# EAGLE schematic mippe_base (EAGLE 9.5.0)
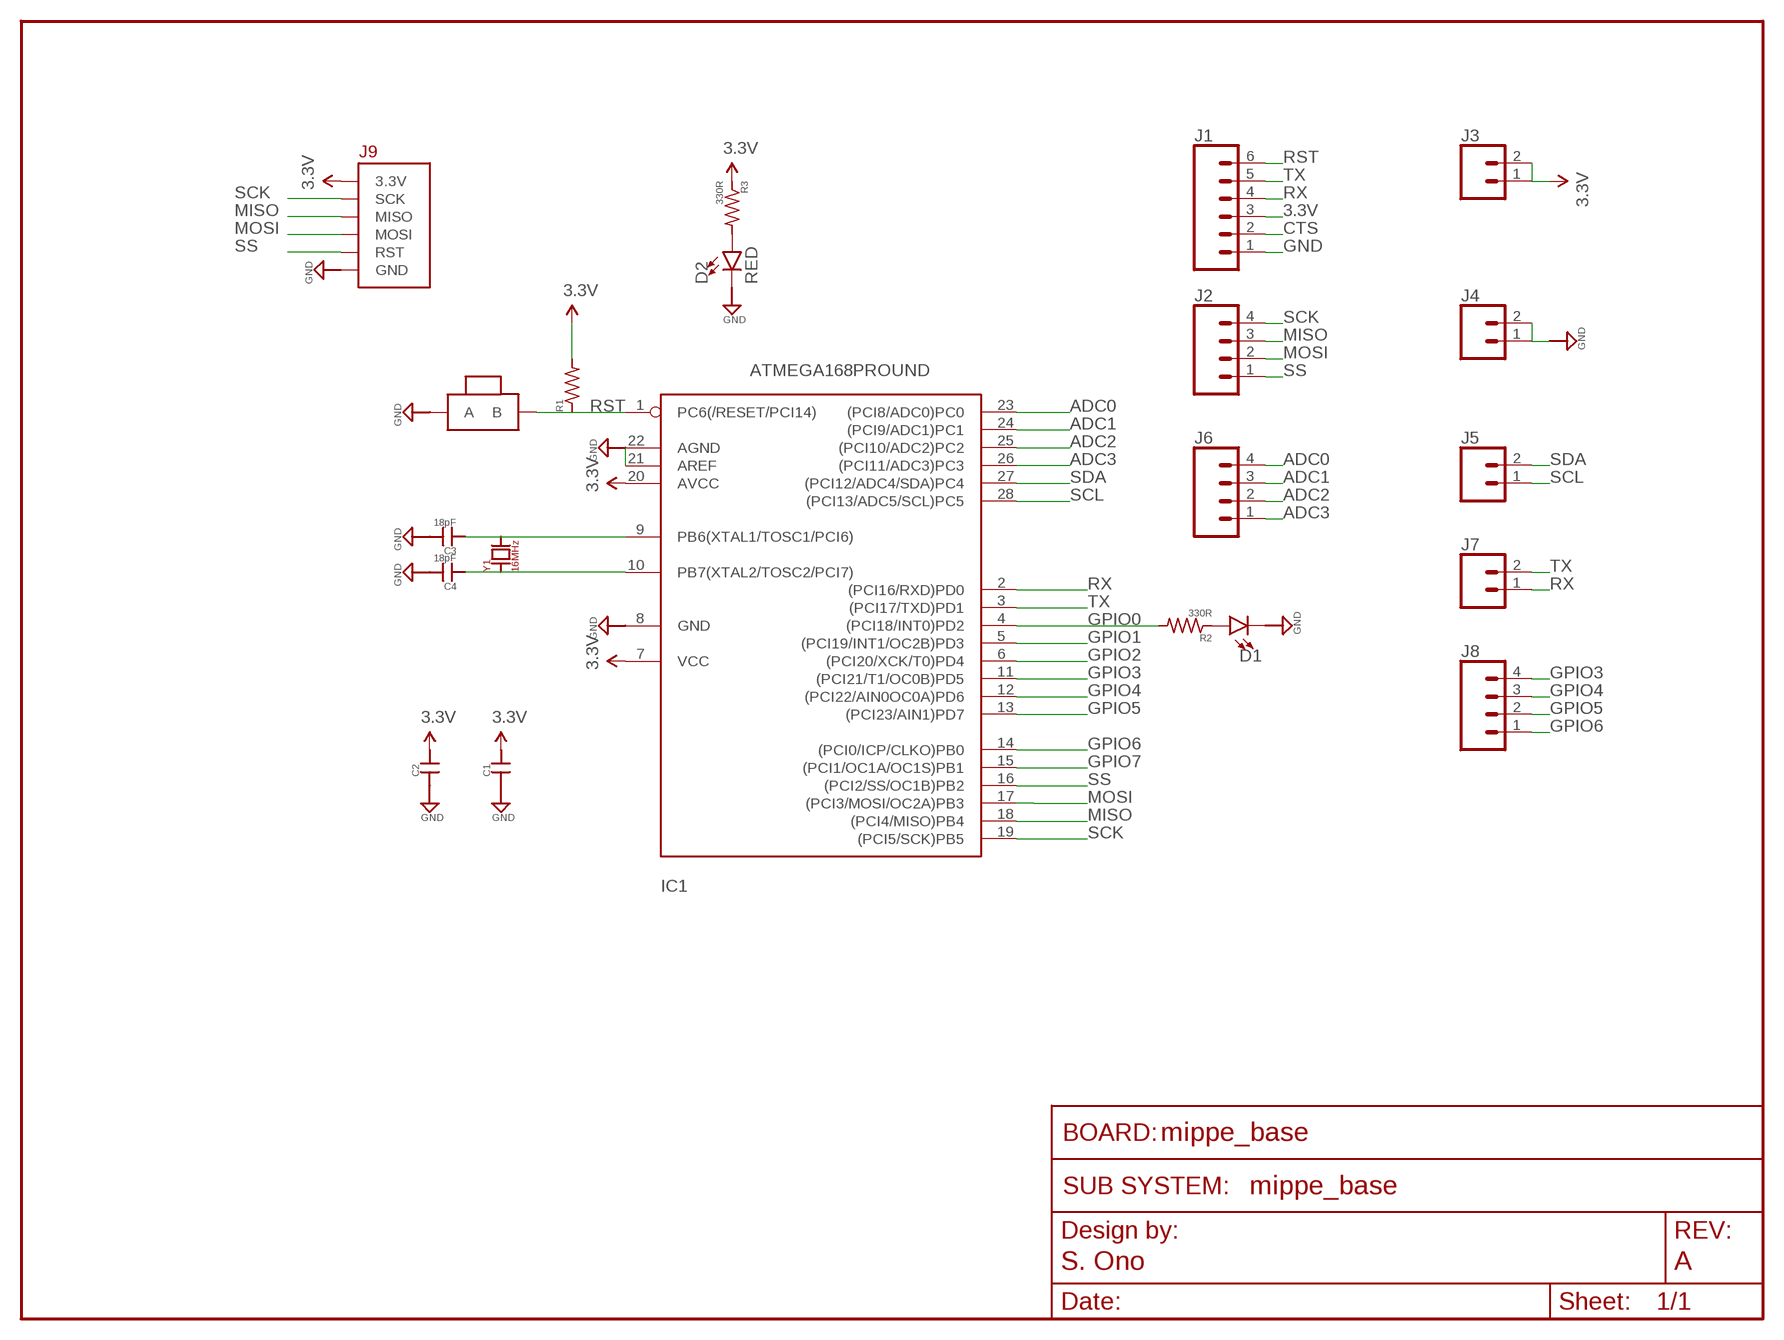
[diagram p0: schematic, sheet 1]
FRAME1 (FRAME_SCHEMATIC): AUTHOR: S. Ono; REV: A; SUBSYSTEM_NAME: mippe_base

## Parts
C1  CAP0603-CAP  [0603-CAP]
C2  CAP0603-CAP  [0603-CAP]
C3  18pF  CAP0603-CAP  [0603-CAP]
C4  18pF  CAP0603-CAP  [0603-CAP]
D1  LED0603  [LED-0603]
D2  RED  LED0603  [LED-0603]
IC1  ATMEGA168PROUND  [DIL28-3-ROUND]
J1  CONN_06NO_SILK_FEMALE_PTH  [1X06_NO_SILK]
J2  CONN_041X04_NO_SILK  [1X04_NO_SILK]
J3  CONN_021X02_NO_SILK  [1X02_NO_SILK]
J4  CONN_021X02_NO_SILK  [1X02_NO_SILK]
J5  CONN_021X02_NO_SILK  [1X02_NO_SILK]
J6  CONN_041X04_NO_SILK  [1X04_NO_SILK]
J7  CONN_021X02_NO_SILK  [1X02_NO_SILK]
J8  CONN_041X04_NO_SILK  [1X04_NO_SILK]
J9  BURNIN  [BURNIN]
R1  R-US_R0603  [R0603]
R2  330R  R-US_R0603  [R0603]
R3  330R  R-US_R0603  [R0603]
SW1  BTN-PTS810  [BTN_PTS810]
Y1  16MHz  CRYSTAL  [HC-49]

## Nets
3.3V: C1.2 C2.2 IC1.7(VCC) IC1.20(AVCC) J1.3 J3.1 J3.2 J9.3.3V R1.2 R3.1
ADC0: IC1.23((PCI8/ADC0)PC0) J6.4
ADC1: IC1.24((PCI9/ADC1)PC1) J6.3
ADC2: IC1.25((PCI10/ADC2)PC2) J6.2
ADC3: IC1.26((PCI11/ADC3)PC3) J6.1
CTS: J1.2
GND: C1.1 C2.1 C3.2 C4.2 D1.C D2.C IC1.8(GND) IC1.21(AREF) IC1.22(AGND) J1.1 J4.1 J4.2 J9.GND SW1.1(A) SW1.2(A)
GPIO0: IC1.4((PCI18/INT0)PD2) R2.2
GPIO1: IC1.5((PCI19/INT1/OC2B)PD3)
GPIO2: IC1.6((PCI20/XCK/T0)PD4)
GPIO3: IC1.11((PCI21/T1/OC0B)PD5) J8.4
GPIO4: IC1.12((PCI22/AIN0OC0A)PD6) J8.3
GPIO5: IC1.13((PCI23/AIN1)PD7) J8.2
GPIO6: IC1.14((PCI0/ICP/CLKO)PB0) J8.1
GPIO7: IC1.15((PCI1/OC1A/OC1S)PB1)
MISO: IC1.18((PCI4/MISO)PB4) J2.3 J9.MISO
MOSI: IC1.17((PCI3/MOSI/OC2A)PB3) J2.2 J9.MOSI
N$1: D1.A R2.1
N$2: D2.A R3.2
N$3: C3.1 IC1.9(PB6(XTAL1/TOSC1/PCI6)) Y1.B
N$4: C4.1 IC1.10(PB7(XTAL2/TOSC2/PCI7)) Y1.A
RST: IC1.1(PC6(/RESET/PCI14)) J1.6 R1.1 SW1.3(B) SW1.4(B)
RX: IC1.2((PCI16/RXD)PD0) J1.4 J7.1
SCK: IC1.19((PCI5/SCK)PB5) J2.4 J9.SCK
SCL: IC1.28((PCI13/ADC5/SCL)PC5) J5.1
SDA: IC1.27((PCI12/ADC4/SDA)PC4) J5.2
SS: IC1.16((PCI2/SS/OC1B)PB2) J2.1 J9.RST
TX: IC1.3((PCI17/TXD)PD1) J1.5 J7.2

## Library data of the parts
C1-C4 = scono:CAP: Capacitor Standard 0603 ceramic capacitor, and 0.1" leaded capacitor.; PIE-INT-REF-NUM: CAPACITOR-GENERIC
D1 D2 = scono:LED: https://www.digikey.com/products/en/optoelectronics/led-indication-discrete/105?k=&pkeyword=&pv7=2&pv1989=0&pv16=5&FV=ffe00069&quantity=0&ColumnSort=0&page=1&pageSize=25
IC1 = scono:ATMEGA168*P: MICROCONTROLLER 16 kBytes FLASH 1 kBytes SRAM 512 Bytes EEPROM USART 8-channel 10 bit ADC
J1 = scono:CONN_06: Multi connection point. Often used as Generic Header-pin footprint for 0.1 inch spaced/style header connections On any of the 0.1 inch spaced packages, you can populate with these: Break Away Headers - Straight <https://www.sparkfun.com/products/116> (PRT-00116) Break Away Male Headers - Right Angle <https://www.sparkfun.com/products/553> (PRT-00553) Female Headers <https://www.sparkfun.com/products/115> (PRT-00115) Break Away Headers - Machine Pin <https://www.sparkfun.com/products/117> (PRT-00117) Break Away Female Headers - Swiss Machine Pin <https://www.sparkfun.com/products/743> (PRT-00743) Arduino Stackable Header - 6 Pin <https://www.sparkfun.com/products/9280> (PRT-09280) For SCREWTERMINALS and SPRING TERMINALS visit here: Screw Terimnals on SparkFun.com <https://www.sparkfun.com/search/results?term=Screw+Terminals> (5mm/3.5mm/2.54mm spacing) This device is also useful as a general connection point to wire up your design to another part of your project. Our various solder wires solder well into these plated through hole pads. Hook-Up Wire - Assortment (Stranded, 22 AWG) <https://www.sparkfun.com/products/11375> (PRT-11375) Hook-Up Wire - Assortment (Solid Core, 22 AWG) <https://www.sparkfun.com/products/11367> (PRT-11367) View the entire wire category on our website here <https://www.sparkfun.com/categories/141>; PROD_ID: CONN-08437
J2 J6 J8 = scono:CONN_04: Multi connection point. Often used as Generic Header-pin footprint for 0.1 inch spaced/style header connections On any of the 0.1 inch spaced packages, you can populate with these: Break Away Headers - Straight <https://www.sparkfun.com/products/116> (PRT-00116) Break Away Male Headers - Right Angle <https://www.sparkfun.com/products/553> (PRT-00553) Female Headers <https://www.sparkfun.com/products/115> (PRT-00115) Break Away Headers - Machine Pin <https://www.sparkfun.com/products/117> (PRT-00117) Break Away Female Headers - Swiss Machine Pin <https://www.sparkfun.com/products/743> (PRT-00743) For SCREWTERMINALS and SPRING TERMINALS visit here: Screw Terimnals on SparkFun.com <https://www.sparkfun.com/search/results?term=Screw+Terminals> (5mm/3.5mm/2.54mm spacing) This device is also useful as a general connection point to wire up your design to another part of your project. Our various solder wires solder well into these plated through hole pads. Hook-Up Wire - Assortment (Stranded, 22 AWG) <https://www.sparkfun.com/products/11375> (PRT-11375) Hook-Up Wire - Assortment (Solid Core, 22 AWG) <https://www.sparkfun.com/products/11367> (PRT-11367) View the entire wire category on our website here <https://www.sparkfun.com/categories/141> Special notes: Molex polarized connector foot print use with SKU : PRT-08231 with associated crimp pins and housings. 1MM SMD Version SKU: PRT-10208; PROD_ID: CONN-09696
J3-J5 J7 = scono:CONN_02: Multi connection point. Often used as Generic Header-pin footprint for 0.1 inch spaced/style header connections On any of the 0.1 inch spaced packages, you can populate with these: Break Away Headers - Straight <https://www.sparkfun.com/products/116> (PRT-00116) Break Away Male Headers - Right Angle <https://www.sparkfun.com/products/553> (PRT-00553) Female Headers <https://www.sparkfun.com/products/115> (PRT-00115) Break Away Headers - Machine Pin <https://www.sparkfun.com/products/117> (PRT-00117) Break Away Female Headers - Swiss Machine Pin <https://www.sparkfun.com/products/743> (PRT-00743) For SCREWTERMINALS and SPRING TERMINALS visit here: Screw Terimnals on SparkFun.com <https://www.sparkfun.com/search/results?term=Screw+Terminals> (5mm/3.5mm/2.54mm spacing) This device is also useful as a general connection point to wire up your design to another part of your project. Our various solder wires solder well into these plated through hole pads. Hook-Up Wire - Assortment (Stranded, 22 AWG) <https://www.sparkfun.com/products/11375> (PRT-11375) Hook-Up Wire - Assortment (Solid Core, 22 AWG) <https://www.sparkfun.com/products/11367> (PRT-11367) View the entire wire category on our website here <https://www.sparkfun.com/categories/141> Special notes: Molex polarized connector foot print use with: PRT-08233 with associated crimp pins and housings. 2.54_SCREWTERM for use with PRT-10571. 3.5mm Screw Terminal footprints for PRT-08084 5mm Screw Terminal footprints for use with PRT-08432
J9 = scono:BURNIN
R1-R3 = scono:R-US_: RESISTOR, American symbol; DESCRIPTION: RESISTOR, American symbol; DISTRIBUTOR: DigiKey; MANUFACTURER: Rohm Semiconductor; NOTES: Cut Tape; PACKAGE: R0603
SW1 = scono:BTN-PTS810: https://www.digikey.com/product-detail/en/c-k/PTS810-SJM-250-SMTR-LFS/CKN10502CT-ND/4176673
Y1 = scono:CRYSTAL